# EAGLE design MLX90614 (EAGLE 9.6.2)
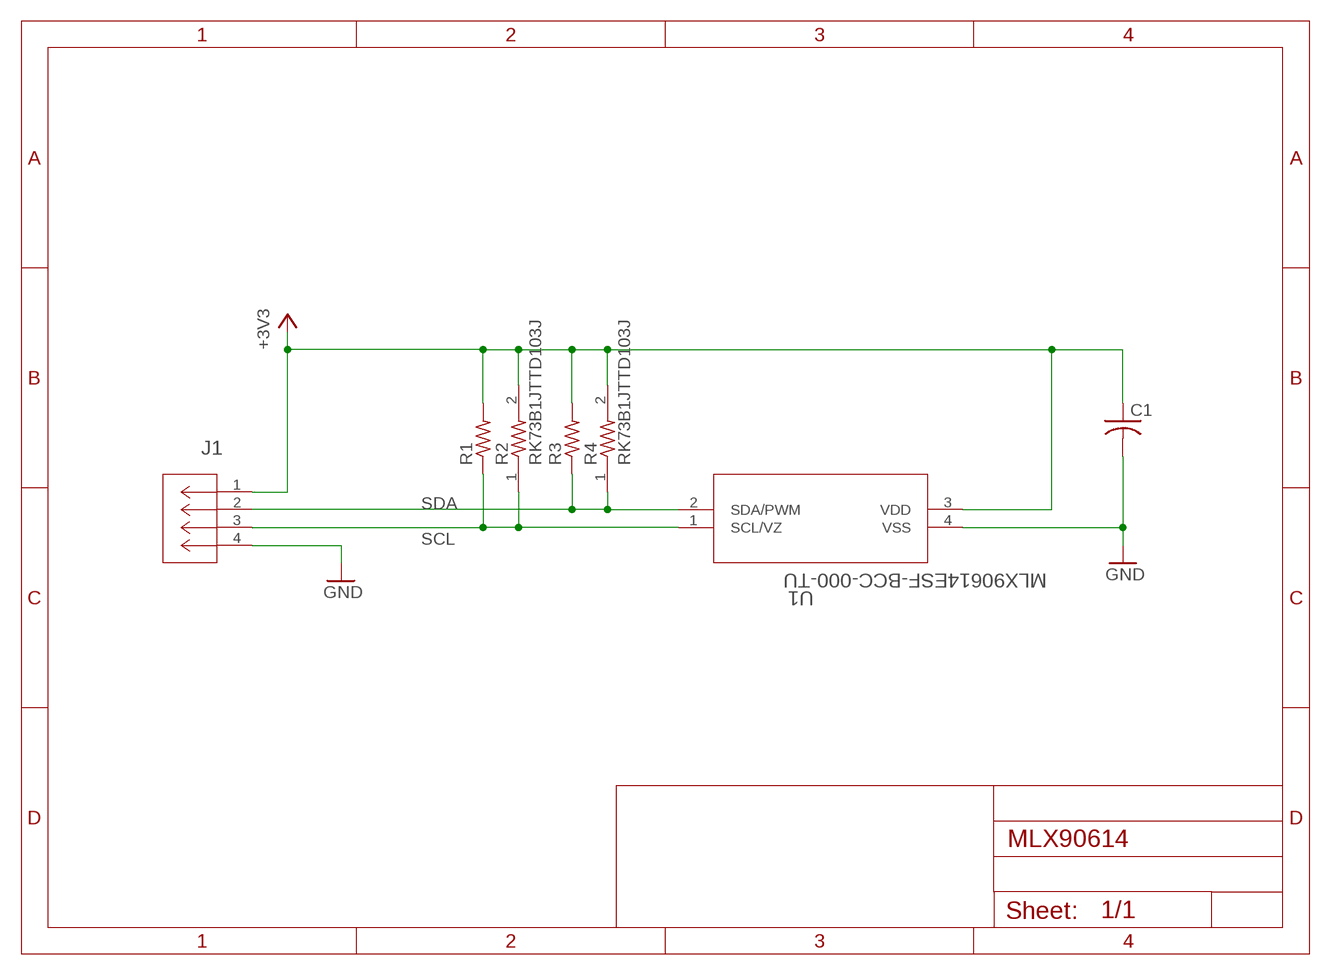
[diagram p0: schematic, sheet 1]

## Parts
C1  C-US025-024X044  [C025-024X044]
J1  S4B-PH-K-S(LF)(SN)  [CONN_S4B-PH-K-S_JST]
R1  R-US_0204/7  [0204/7]
R2  RK73B1JTTD103J  [RESC1608X55N]
R3  R-US_0204/7  [0204/7]
R4  RK73B1JTTD103J  [RESC1608X55N]
U1  MLX90614ESF-BCC-000-TU  [MLX90614XCC_MEL]

## Nets
+3V3: C1.1 J1.1 R1.2 R2.2 R3.2 R4.2 U1.3(VDD)
GND: C1.2 J1.4 U1.4(VSS)
SCL: J1.3 R1.1 R2.1 U1.1(SCL/VZ)
SDA: J1.2 R3.1 R4.1 U1.2(SDA/PWM)

## Library data of the parts
C1 = AU222_F:C-US: CAPACITOR, American symbol; SPICEPREFIX: C
J1 = AU222_F:S4B-PH-K-S(LF)(SN); COPYRIGHT: Copyright (C) 2023 Ultra Librarian. All rights reserved.; DIGI-KEY_PART_NUMBER_1: 455-1721-ND; DIGI-KEY_PART_NUMBER_2: 455-1721-NDL; MANUFACTURER_PART_NUMBER: S4B-PH-K-S(LF)(SN); MFR_NAME: JST
R1 R3 = AU222_F:R-US_: RESISTOR, American symbol; SPICEPREFIX: R
R2 R4 = AU222_F:RK73B1JTTD103J: RC0603 10K 5% 0,1W; DESCRIPTION: 10 kOhms ±5% 0.1W, 1/10W Chip Resistor 0603 (1608 Metric) Automotive AEC-Q200, Moisture Resistant Thick Film; DIGI-KEY_PART_NUMBER: 2019-RK73B1JTTD103JCT-ND; MF: KOA Speer; MP: RK73B1JTTD103J; PACKAGE: 0603 KOA Speer; PURCHASE-URL: https://pricing.snapeda.com/search/part/RK73B1JTTD103J/?ref=eda
U1 = AU222_F:MLX90614ESF-BCC-000-TU; COPYRIGHT: Copyright (C) 2023 Ultra Librarian. All rights reserved.; DIGI-KEY_PART_NUMBER_1: MLX90614ESF-BCC-000-TU-ND; MANUFACTURER_PART_NUMBER: MLX90614ESF-BCC-000-TU; MFR_NAME: Melexis

## Board
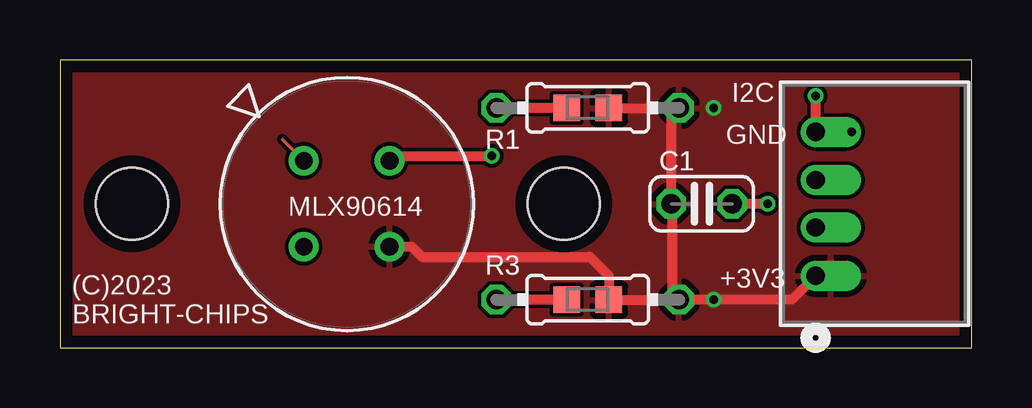
[diagram p1: board, top side]
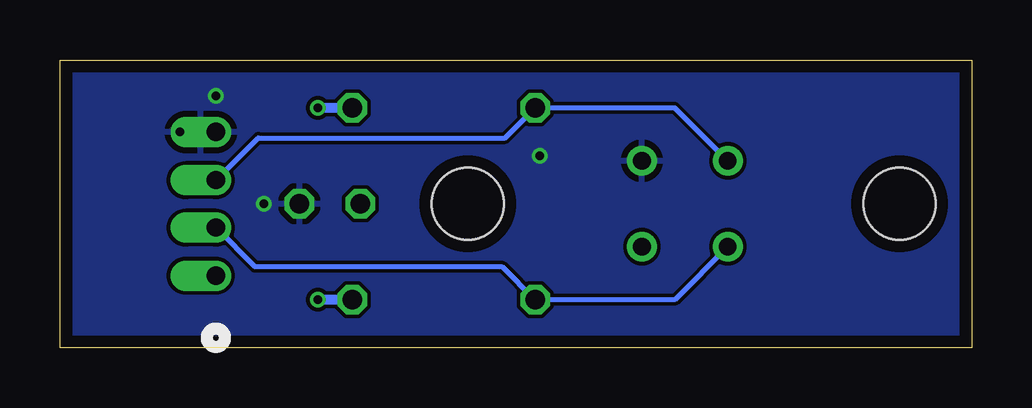
[diagram p2: board, bottom side, seen from below]

Size 38 x 12 mm. Coordinates in mm from the lower left corner, seen from the top.
Outline: 0,0 38,0 38,12 0,12 0,0
Copper layers (1*16): Top 0.035mm / dielectric 1.6mm / Bottom 0.035mm
Design rules "Elecrow_2-layer_PCB_eagle_rule": minimum track width 6mil, minimum drill 12mil, track to track 6mil, track to pad 6mil, pad to pad 6mil, via to via 8mil, smd to smd 0mil, copper to edge 20mil, drill to drill 10mil, minimum pad ring 6mil, minimum via ring 6mil, stop-mask expansion 0mil, vias tented up to drill 100mil, thermal gap 10mil
Holes 3 mm at 3,6 21,6

### Footprints (pad centres in the part's own frame; a part is rotated, then mirrored left to right if it is on the bottom)
C025-024X044 = drill 0.813 octagon: 1 -1.27,0; 2 1.27,0
CONN_S4B-PH-K-S_JST = drill 0.762 pad 1.27 offset: 1 0,0; 2 2.007,0; 3 3.988,0; 4 5.994,0
0204/7 = drill 0.813 octagon: 1 -3.81,0; 2 3.81,0
RESC1608X55N = smd 1.1 x 1.1: 1 -0.88,0; 2 0.88,0
MLX90614XCC_MEL = drill 0.737 pad 1.245: 1 0,0; 2 0,-3.581; 3 3.581,-3.581; 4 3.581,0

### Placement (x,y rotation side)
C1  26.75,6 0 top
J1  31.5,3 90 top
R1  22,10 0 top
R2  22,10 0 top
R3  22,2 0 top
R4  22,2 0 top
U1  10.16,7.79 0 top

### Tracks (layer width: path | path; a pad name or v marks a point on that pad's centre or on a via)
+3V3  (via drill 0.35)
  Top 0.406: R2.2 25.5,10 | 25.5,10 R1.2 | 25.5,2 R4.2 22.88,3 22.09,3.79 15.08,3.79 14.66,4.21 U1.3 | 25.5,2 R3.2 30.5,2 J1.1 | 25.5,2 25.5,5.98 C1.1 25.48,9.98 25.5,10
  Bottom 0.406: R1.2 v27.25,10 | R3.2 v27.25,2
  pour Top: 0.5,11.5 0.5,0.5 37.5,0.5 37.5,11.5
GND  (via drill 0.35)
  Top 0.406: v29.5,6 C1.2 | v31.5,10.5 J1.4 v32.99,8.99 v33,9 | U1.4 13.95,8 v18,8
  pour Bottom: 0.5,11.5 0.5,0.5 37.5,0.5 37.5,11.5
SCL
  Top 0.406: R2.1 R1.1
  Bottom 0.2: J1.3 29.74,8.75 19.44,8.75 R1.1 12.37,10 U1.1
SDA
  Top 0.406: R4.1 R3.1
  Bottom 0.2: J1.2 29.88,3.38 19.57,3.38 R3.1 12.37,2 U1.2

### Text on the board
tPlace: I2C | GND | MLX90614 | +3V3 | (C)2023 / BRIGHT-CHIPS
_tNames: R1 | C1 | R3
_tValues: U1 | J1